# Altium project IEEE_Very_Small_v1.PrjPCB
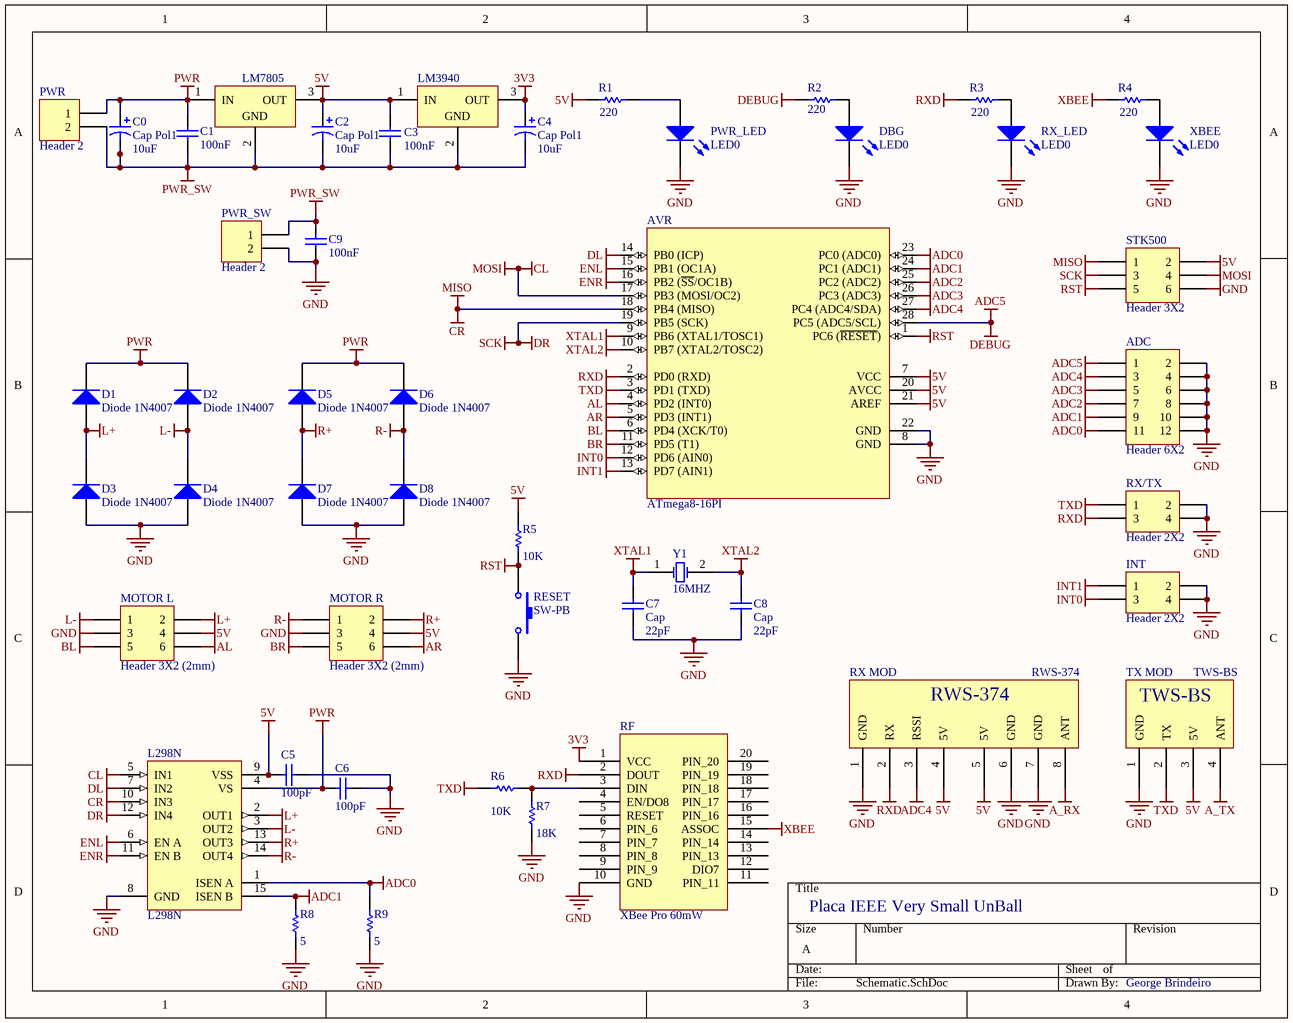
[diagram p0: Schematic.SchDoc]
1 sheet, 48 parts. Net scope: global (net labels, ports and power ports of the same name join across sheets).
Board file: Board.PcbDoc

## Sheet Schematic.SchDoc: Placa IEEE Very Small UnBall
size A; Author: George Andrew Brindeiro; CompanyName: UnBall; DrawnBy: George Andrew Brindeiro; Revision: A0; SheetNumber: 1; SheetTotal: 1

### Parts
ADC  Header 6X2  [HDR2X6]
AVR  ATmega8-16PI  [28P3]
C0  Cap Pol1  value 10uF  [B]
C1  value 100nF  [C_NANO_HOLES]  (hidden comment: Cap)
C2  Cap Pol1  value 10uF  [B]
C3  value 100nF  [C_NANO_HOLES]  (hidden comment: Cap)
C4  Cap Pol1  value 10uF  [B]
C5  value 100pF  [C_NANO_HOLES]  (hidden comment: Cap)
C6  value 100pF  [C_NANO_HOLES]  (hidden comment: Cap)
C7  Cap  value 22pF  [C_NANO_HOLES]
C8  Cap  value 22pF  [C_NANO_HOLES]
C9  value 100nF  [C_NANO_HOLES]  (hidden comment: Cap)
D1  Diode 1N4007  [DO-41]
D2  Diode 1N4007  [DO-41]
D3  Diode 1N4007  [DO-41]
D4  Diode 1N4007  [DO-41]
D5  Diode 1N4007  [DO-41]
D6  Diode 1N4007  [DO-41]
D7  Diode 1N4007  [DO-41]
D8  Diode 1N4007  [DO-41]
DBG  LED0  [B]
INT  Header 2X2  [HDR2X2]
L298N  L298N  [Multiwatt15V]
LM3940  LM3940IT-3.3  [T03B]  (value not drawn)
LM7805  µA7805CKC  [KC03]  (value not drawn)
MOTOR_L  Header 3X2 (2mm)  [HDR2x3_2MM]
MOTOR_R  Header 3X2 (2mm)  [HDR2x3_2MM]
PWR  Header 2  [HDR1X2]
PWR_LED  LED0  [B]
PWR_SW  Header 2  [HDR1X2]
R1  value 220  [AXIAL-0.3]
R2  value 220  [AXIAL-0.3]
R3  value 220  [AXIAL-0.3]
R4  value 220  [AXIAL-0.3]
R5  value 10K  [AXIAL-0.3]
R6  value 10K  [AXIAL-0.3]
R7  value 18K  [AXIAL-0.3]
R8  value 5  [AXIAL-0.3]
R9  value 5  [AXIAL-0.3]
RESET  SW-PB  [PUSHBUTTON]
RF  XBee Pro 60mW  [XBEE_PRO]
RX/TX  Header 2X2  [HDR2X2]
RX_LED  LED0  [B]
RX_MOD  RWS-374  [RWS-374]
STK500  Header 3X2  [HDR2X3]
TX_MOD  TWS-BS  [TWS-BS]
XBEE  LED0  [B]
Y1  16MHZ  [BCY-W2/E4.7]

### Nets
3V3: C4.1 LM3940.3(OUT) RF.1(VCC)
5V: AVR.7(VCC) AVR.20(AVCC) AVR.21(AREF) C2.1 C3.1 C5.1 L298N.9(VSS) LM3940.1(IN) LM7805.3(OUT) MOTOR_L.4 MOTOR_R.4 R1.1 R5.2 RX_MOD.4(5V) RX_MOD.5(5V) STK500.2 TX_MOD.3(5V)
A_RX: RX_MOD.8(ANT)
A_TX: TX_MOD.4(ANT)
ADC0: ADC.11 AVR.23(PC0_(ADC0)) L298N.1(ISEN_A) R9.2
ADC1: ADC.9 AVR.24(PC1_(ADC1)) L298N.15(ISEN_B) R8.2
ADC2: ADC.7 AVR.25(PC2_(ADC2))
ADC3: ADC.5 AVR.26(PC3_(ADC3))
ADC4: ADC.3 AVR.27(PC4_(ADC4/SDA)) RX_MOD.3(RSSI)
ADC5: ADC.1 AVR.28(PC5_(ADC5/SCL)) R2.1  [also labelled DEBUG]
AL: AVR.4(PD2_(INT0)) MOTOR_L.6
AR: AVR.5(PD3_(INT1)) MOTOR_R.6
BL: AVR.6(PD4_(XCK/T0)) MOTOR_L.5
BR: AVR.11(PD5_(T1)) MOTOR_R.5
CL: AVR.17(PB3_(MOSI/OC2)) L298N.5(IN1) STK500.4  [also labelled MOSI]
CR: AVR.18(PB4_(MISO)) L298N.10(IN3) STK500.1  [also labelled MISO]
DL: AVR.14(PB0_(ICP)) L298N.7(IN2)
DR: AVR.19(PB5_(SCK)) L298N.12(IN4) STK500.3  [also labelled SCK]
ENL: AVR.15(PB1_(OC1A)) L298N.6(EN_A)
ENR: AVR.16(PB2_(~{SS}/OC1B)) L298N.11(EN_B)
GND: ADC.2 ADC.4 ADC.6 ADC.8 ADC.10 ADC.12 AVR.8(GND) AVR.22(GND) C5.2 C6.2 C7.2 C8.2 C9.2 D3.1(A) D4.1(A) D7.1(A) D8.1(A) DBG.2(K) INT.2 INT.4 L298N.8(GND) MOTOR_L.3 MOTOR_R.3 PWR_LED.2(K) PWR_SW.2 R7.2 R8.1 R9.1 RESET.2 RF.10(GND) RX/TX.2 RX/TX.4 RX_LED.2(K) RX_MOD.1(GND) RX_MOD.6(GND) RX_MOD.7(GND) STK500.6 TX_MOD.1(GND) XBEE.2(K)
INT0: AVR.12(PD6_(AIN0)) INT.3
INT1: AVR.13(PD7_(AIN1)) INT.1
L+: D1.1(A) D3.2(K) L298N.2(OUT1) MOTOR_L.2
L-: D2.1(A) D4.2(K) L298N.3(OUT2) MOTOR_L.1
PWR: C0.1 C1.1 C6.1 D1.2(K) D2.2(K) D5.2(K) D6.2(K) L298N.4(VS) LM7805.1(IN) PWR.1
PWR_SW: C0.2 C1.2 C2.2 C3.2 C4.2 C9.1 LM3940.2(GND) LM7805.2(GND) PWR.2 PWR_SW.1
R+: D5.1(A) D7.2(K) L298N.13(OUT3) MOTOR_R.2
R-: D6.1(A) D8.2(K) L298N.14(OUT4) MOTOR_R.1
RST: AVR.1(PC6_(~{RESET})) R5.1 RESET.1 STK500.5
RXD: AVR.2(PD0_(RXD)) R3.1 RF.2(DOUT) RX/TX.3 RX_MOD.2(RX)
TXD: AVR.3(PD1_(TXD)) R6.2 RX/TX.1 TX_MOD.2(TX)
XBEE: R4.1 RF.15(ASSOC)
XTAL1: AVR.9(PB6_(XTAL1/TOSC1)) C7.1 Y1.1(OSC1)
XTAL2: AVR.10(PB7_(XTAL2/TOSC2)) C8.1 Y1.2(OSC2)
NetDBG_1: DBG.1(A) R2.2
NetPWR_LED_1: PWR_LED.1(A) R1.2
NetR3_2: R3.2 RX_LED.1(A)
NetR4_2: R4.2 XBEE.1(A)
NetR6_1: R6.1 R7.1 RF.3(DIN)

Not connected (* = marked no-connect by the designer): RF 4(EN/DO8) 5(RESET) 6(PIN_6) 7(PIN_7) 8(PIN_8) 9(PIN_9) 11(PIN_11) 12(DIO7) 13(PIN_13) 14(PIN_14) 16(PIN_16) 17(PIN_17) 18(PIN_18) 19(PIN_19) 20(PIN_20)

### Notes on the sheet
- Placa IEEE Very Small UnBall
- George Brindeiro

### Library data of the parts
ADC = Header 6X2: Header, 6-Pin, Dual row; LatestRevisionDate: 17-Jul-2002; LatestRevisionNote: Re-released for DXP Platform.; Publisher: Altium Limited
AVR = ATmega8-16PI: 8-Bit AVR Microcontroller with 8K Bytes of In-System Programmable Flash Memory; Published: 17-Sep-2003; LatestRevisionDate: 04-Mar-2005; LatestRevisionNote: Stylized 3D Model Added.; PackageReference: 28P3; Publisher: Altium Limited; ComponentLink1Description: Manufacturer Link; ComponentLink1URL: http://www.atmel.com; ComponentLink2Description: Datasheet; ComponentLink2URL: http://www.atmel.com/dyn/resources/prod_documents/doc2486.pdf; DatasheetVersion: 2486H-AVR-09/02; PackageVersion: revB, Sep-2001; PackageDescription: DIP; 28 Leads; Row Spacing 7.62 mm; Pitch 2.54 mm
C0 C2 C4 = Cap Pol1: Polarized Capacitor (Radial); Published: 8-Jun-2000; LatestRevisionDate: 17-Jul-2002; LatestRevisionNote: Re-released for DXP Platform.; PackageReference: RB7.6-15; Publisher: Altium Limited; PackageDescription: Polarized Capacitor (Radial); 2 Leads
C1 C3 C5-C9 = Cap: Capacitor; Published: 8-Jun-2000; LatestRevisionDate: 17-Jul-2002; LatestRevisionNote: Re-released for DXP Platform.; PackageReference: RAD-0.3; Publisher: Altium Limited
D1-D8 = Diode 1N4007: 1 Amp General Purpose Rectifier; Published: 8-Jun-2000; LatestRevisionDate: 17-Jul-2002; LatestRevisionNote: Re-released for DXP Platform.; PackageReference: DO-41; Publisher: Altium Limited; Code_JEDEC: DO-204-AL; ComponentLink1Description: Manufacturer Link; ComponentLink1URL: http://www.fairchildsemi.com/; ComponentLink2Description: Datasheet; ComponentLink2URL: http://www.fairchildsemi.com/ds/1N%2F1N4001.pdf; DatasheetVersion: 1998; PackageDescription: Diode, Axial; Body 5.2 x 2.7 mm (LxDia. max), Lead Dia. 0.86 mm (max); PackageVersion: Aug-1999
DBG PWR_LED RX_LED XBEE = LED0: Typical INFRARED GaAs LED; Published: 8-Jun-2000; LatestRevisionDate: 08-Jul-2005; LatestRevisionNote: Mech Layer 1 removed.; PackageReference: LED-0; Publisher: Altium Limited; PackageDescription: LED; 2 Leads
INT RX/TX = Header 2X2: Header, 2-Pin, Dual row; LatestRevisionDate: 17-Jul-2002; LatestRevisionNote: Re-released for DXP Platform.; Publisher: Altium Limited
L298N = L298N: Dual Full Bridge Driver; Published: 8-Jun-2000; LatestRevisionDate: 14-May-2007; LatestRevisionNote: Mapped to vertical PCB.; DatasheetVersion: Jul-1999; PackageReference: Multiwatt15V; Publisher: Altium Limited; PackageDescription: TO, Thru-Hole, Vertical, Heatsink Mounted; 15 Bent Staggered Leads; Pitch 1.27 mm; ComponentLink1Description: Manufacturer Link; ComponentLink1URL: http://www.st.com/; ComponentLink2Description: Datasheet; ComponentLink2URL: http://www.st.com/stonline/products/literature/ds/1773/l298.pdf
LM3940 = LM3940IT-3.3: 1A Low Dropout Regulator for 5V to 3.3V Conversion; Manufacturer: National Semiconductor; CompType: LDO IC; PackageTopMarking: NSUZXYTTE#*LM3940IT*-3.3 P+; PowerWise: N; Published: 4-Dec-2008; DatasheetVersion: Jul-2007; PackageVersion: revL, Jan-1992; PackageReference: T03B; Publisher: Altium Limited; PackageDescription: TO-220, Molded, 3 Lead, Straight; PartNumber: LM3940IT-3.3; RoHS: O; PinCount: 3; DigiKeyPartNumber: LM3940IT-3.3-ND; ComponentLink1Description: LM3940 Datasheet; ComponentLink1URL: http://www.national.com/ds/LM/LM3940.pdf; ComponentLink2Description: LM3940 Web Page; ComponentLink2URL: http://www.national.com/pf/LM/LM3940.html; ComponentLink3Description: T03B Package Page; ComponentLink3URL: http://www.national.com/packaging/folders/t03b.html
LM7805 = µA7805CKC: Positive-Voltage Regulator; Note: Pin 2 is electrically connected to TAB.; Published: 15-Apr-2002; PackageReference: KC03; Publisher: Altium Limited; ComponentLink1Description: Manufacturer Link; ComponentLink1URL: http://www.ti.com/; ComponentLink2Description: Datasheet; ComponentLink2URL: http://www-s.ti.com/sc/ds/ua7805.pdf; DatasheetVersion: Jul-1999; PackageDescription: TO, Thru-Hole, Vertical, Heatsink Mounted; 3 In-Line Leads; Pitch 2.54 mm; PackageVersion: Sep-1995
MOTOR_L MOTOR_R STK500 = Header 3X2: Header, 3-Pin, Dual row; LatestRevisionDate: 17-Jul-2002; LatestRevisionNote: Re-released for DXP Platform.; Publisher: Altium Limited
PWR PWR_SW = Header 2: Header, 2-Pin; LatestRevisionDate: 17-Jul-2002; LatestRevisionNote: Re-released for DXP Platform.; Publisher: Altium Limited
R1-R9 = Res1: Resistor; Published: 8-Jun-2000; LatestRevisionDate: 17-Jul-2002; LatestRevisionNote: Re-released for DXP Platform.; PackageReference: AXIAL-0.3; Publisher: Altium Limited; PackageDescription: Axial Device, Thru-Hole; 2 Leads; 0.3 in Pin Spacing
RESET = SW-PB: Switch; Published: 24-Mar-1999; LatestRevisionDate: 17-Jul-2002; LatestRevisionNote: Re-released for DXP Platform.; PackageReference: SPST-2; Publisher: Altium Limited
RF = XBee
RX_MOD = RWS-374: Receptor RF Soldafria
TX_MOD = TWS-BS: Transmissor RF Soldafria
Y1 = ECS-120-32-1: Crystal Oscillator; Published: 17-Jul-2002; DatasheetDocument: 18-Apr-2000; PackageReference: HC-49U; Publisher: Altium Limited; ComponentLink1Description: Manufacturer Link; ComponentLink1URL: http://www.ecsxtal.com/; ComponentLink2Description: Datasheet; ComponentLink2URL: http://www.ecsxtal.com/pdf2/HC49U.PDF